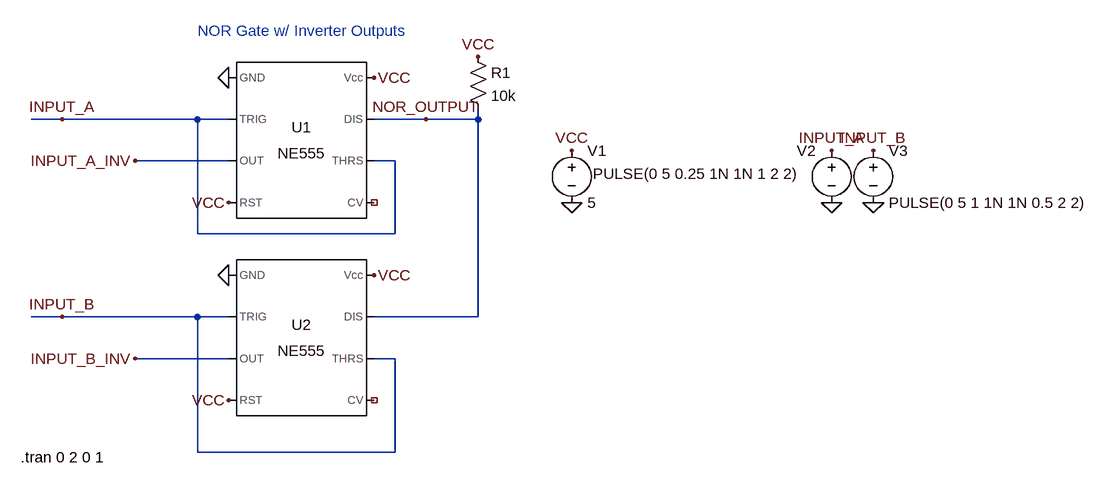
[diagram p0: schematic 555_NOR_Gate.asc]
555_NOR_Gate.asc, the LTspice schematic file:
Version 4
SHEET 1 1352 680
WIRE -224 48 -272 48
WIRE -16 48 -224 48
WIRE 32 48 -16 48
WIRE 336 48 256 48
WIRE 416 48 416 32
WIRE 416 48 336 48
WIRE 32 112 -112 112
WIRE 288 112 256 112
WIRE -16 224 -16 48
WIRE 288 224 288 112
WIRE 288 224 -16 224
WIRE -224 352 -272 352
WIRE -16 352 -224 352
WIRE 32 352 -16 352
WIRE 416 352 416 48
WIRE 416 352 256 352
WIRE 32 416 -112 416
WIRE 288 416 256 416
WIRE -16 560 -16 352
WIRE 288 560 288 416
WIRE 288 560 -16 560
FLAG 560 176 0
FLAG 560 96 VCC
FLAG 32 -16 0
FLAG 256 -16 VCC
FLAG 32 288 0
FLAG 256 288 VCC
FLAG -112 112 INPUT_A_INV
FLAG -112 416 INPUT_B_INV
FLAG -224 48 INPUT_A
FLAG -224 352 INPUT_B
FLAG 416 -48 VCC
FLAG 336 48 NOR_OUTPUT
FLAG 960 176 0
FLAG 960 96 INPUT_A
FLAG 1024 176 0
FLAG 1024 96 INPUT_B
FLAG 32 176 VCC
FLAG 32 480 VCC
SYMBOL voltage 560 80 R0
SYMATTR InstName V1
SYMATTR Value 5
SYMBOL Misc\\NE555 144 80 R0
SYMATTR InstName U1
SYMBOL Misc\\NE555 144 384 R0
SYMATTR InstName U2
SYMBOL res 400 -64 R0
SYMATTR InstName R1
SYMATTR Value 10k
SYMBOL voltage 960 80 M0
WINDOW 3 49 52 Left 2
WINDOW 123 0 0 Left 0
WINDOW 39 0 0 Left 0
SYMATTR Value PULSE(0 5 0.25 1N 1N 1 2 2)
SYMATTR InstName V2
SYMBOL voltage 1024 80 R0
WINDOW 123 0 0 Left 0
WINDOW 39 0 0 Left 0
SYMATTR InstName V3
SYMATTR Value PULSE(0 5 1 1N 1N 0.5 2 2)
TEXT -16 -88 Left 2 ;NOR Gate w/ Inverter Outputs
TEXT -288 568 Left 2 !.tran 0 2 0 1

The netlist it stands for:
* 555_NOR_Gate.asc
V1 VCC 0 5
XU1 0 INPUT_A INPUT_A_INV VCC NC_01 INPUT_A NOR_OUTPUT VCC NE555  ; pins GND TRIG OUT RST CV THRS DIS Vcc
XU2 0 INPUT_B INPUT_B_INV VCC NC_02 INPUT_B NOR_OUTPUT VCC NE555  ; pins GND TRIG OUT RST CV THRS DIS Vcc
R1 VCC NOR_OUTPUT 10k
V2 INPUT_A 0 PULSE(0 5 0.25 1N 1N 1 2 2)
V3 INPUT_B 0 PULSE(0 5 1 1N 1N 0.5 2 2)
* NOR Gate w/ Inverter Outputs
.tran 0 2 0 1
.lib NE555.sub
.backanno
.end

* Results of the author's LTspice run, read from the files saved beside the schematic
* Operating Point, zero values left out:
*   V(vcc) = 5 V
*   V(nor_output) = 5 V
*   V(input_a_inv) = 5 V
*   V(input_b_inv) = 5 V
*   I(R1) = 13.34 nA
*   I(V1) = -3.222 mA
*   Ix(u1:1) = -1.611 mA
*   Ix(u1:4) = 22.67 µA
*   Ix(u1:7) = 6.671 nA
*   Ix(u1:8) = 1.588 mA
*   Ix(u2:1) = -1.611 mA
*   Ix(u2:4) = 22.67 µA
*   Ix(u2:7) = 6.671 nA
*   Ix(u2:8) = 1.588 mA
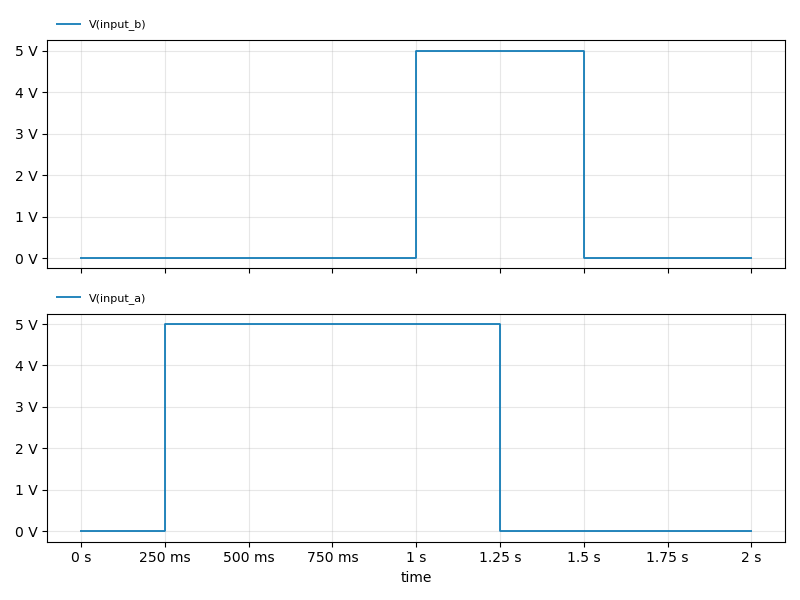
[diagram p1: Transient Analysis of 555_NOR_Gate.asc, plotted from the saved traces]
* Transient Analysis, 1 run:
*   V(input_b): min 0 V, max 5 V, average 1.25 V, rms 2.5 V, last 0 V
*   V(input_a): min 0 V, max 5 V, average 2.5 V, rms 3.536 V, last 0 V